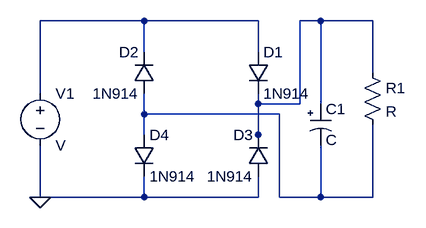
[diagram p0: schematic Draft3.asc]
Draft3.asc, the LTspice schematic file:
Version 4
SHEET 1 880 680
WIRE 240 16 80 16
WIRE 416 16 240 16
WIRE 512 16 480 16
WIRE 592 16 512 16
WIRE 240 64 240 16
WIRE 416 64 416 16
WIRE 592 96 592 16
WIRE 80 128 80 16
WIRE 416 144 416 128
WIRE 480 144 480 16
WIRE 480 144 416 144
WIRE 512 144 512 16
WIRE 240 160 240 128
WIRE 448 160 240 160
WIRE 240 192 240 160
WIRE 416 192 416 144
WIRE 416 208 416 192
WIRE 80 288 80 208
WIRE 240 288 240 256
WIRE 240 288 80 288
WIRE 416 288 416 256
WIRE 416 288 240 288
WIRE 448 288 448 160
WIRE 512 288 512 208
WIRE 512 288 448 288
WIRE 592 288 592 176
WIRE 592 288 512 288
FLAG 80 288 0
SYMBOL voltage 80 112 R0
SYMATTR InstName V1
SYMBOL diode 224 192 R0
SYMATTR InstName D4
SYMATTR Value 1N914
SYMBOL diode 400 64 R0
SYMATTR InstName D1
SYMATTR Value 1N914
SYMBOL diode 256 128 R180
WINDOW 0 24 64 Left 2
WINDOW 3 24 0 Left 2
SYMATTR InstName D2
SYMATTR Value 1N914
SYMBOL diode 432 256 R180
WINDOW 0 24 64 Left 2
WINDOW 3 24 0 Left 2
SYMATTR InstName D3
SYMATTR Value 1N914
SYMBOL polcap 496 144 R0
SYMATTR InstName C1
SYMBOL res 576 80 R0
SYMATTR InstName R1

The netlist it stands for:
* Draft3.asc
V1 N001 0 V
D4 N003 0 1N914
D1 N001 N002 1N914
D2 N003 N001 1N914
D3 0 N002 1N914
C1 N002 N003 C
R1 N002 N003 R
.model D D
.lib standard.dio
.backanno
.end